# EAGLE design radical-pneu (EAGLE 7.2.0)
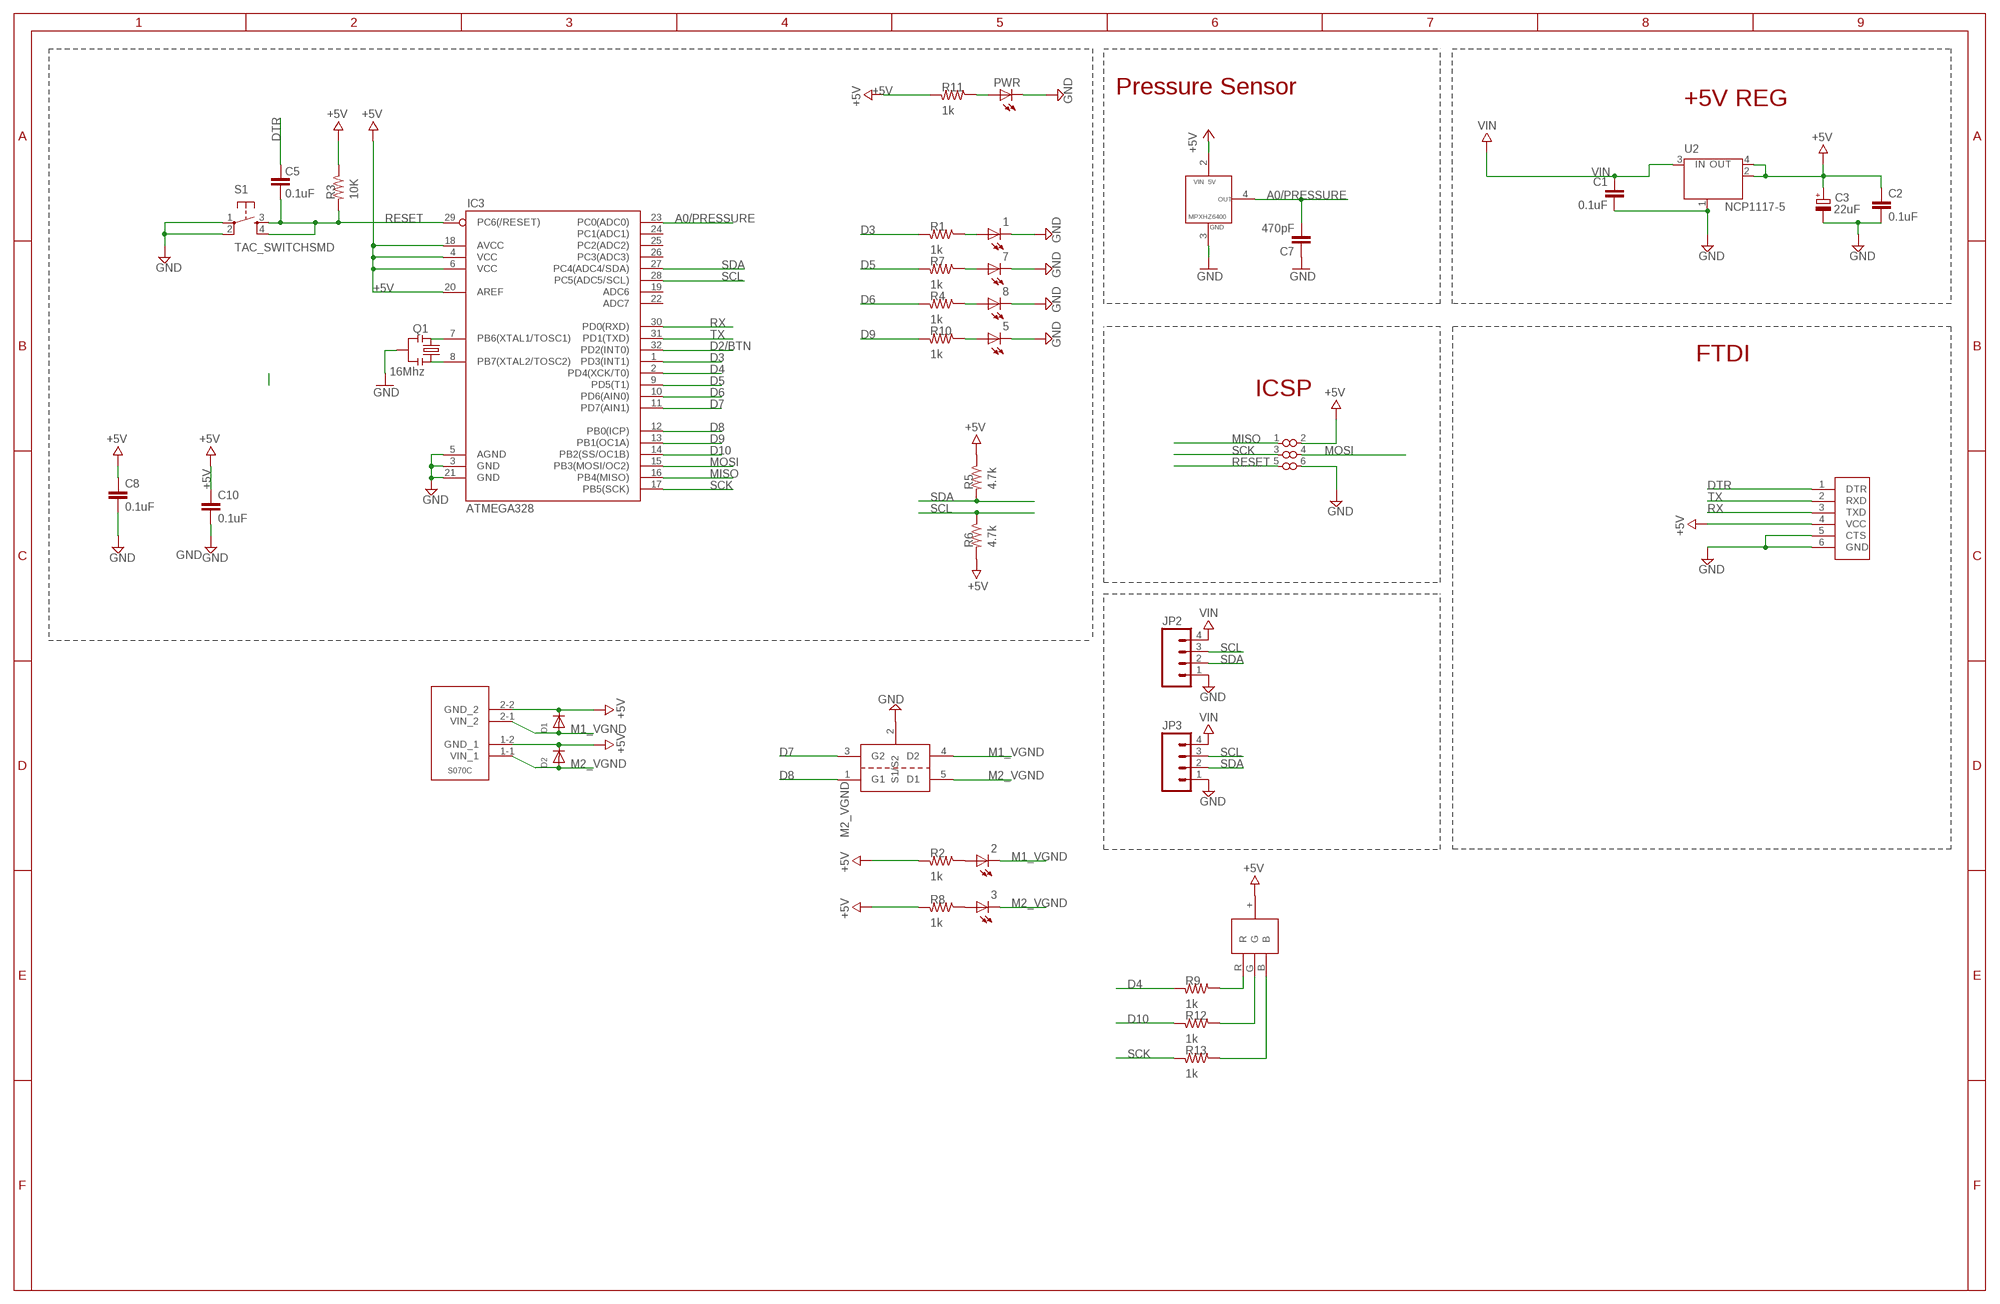
[diagram p0: schematic, sheet 1]

## Parts
1  LEDCHIPLED_0603  [CHIPLED_0603]
2  LEDCHIPLED_0603  [CHIPLED_0603]
3  LEDCHIPLED_0603  [CHIPLED_0603]
5  LEDCHIPLED_0603  [CHIPLED_0603]
7  LEDCHIPLED_0603  [CHIPLED_0603]
8  LEDCHIPLED_0603  [CHIPLED_0603]
C1  0.1uF  CAP0603-CAP  [0603-CAP]
C2  0.1uF  CAP0603-CAP  [0603-CAP]
C3  22uF  CPOL-EUSMCB  [SMC_B]
C5  0.1uF  CAP0805  [0805]
C7  470pF  CAP0805  [0805]
C8  0.1uF  CAP0603-CAP  [0603-CAP]
C10  0.1uF  CAP0603-CAP  [0603-CAP]
D1  DIODESOD-123  [SOD-123]
D2  DIODESOD-123  [SOD-123]
IC3  ATMEGA328  ATMEGA168  [TQFP32-08]
JP2  M04PTH  [1X04]
JP3  M04PTH  [1X04]
PWR  LEDCHIPLED_0603  [CHIPLED_0603]
Q1  16Mhz  RESONATORSMD  [RESONATOR-SMD]
R1  1k  RESISTOR0805-RES  [0805]
R2  1k  RESISTOR0805-RES  [0805]
R3  10K  RESISTOR0805-RES  [0805]
R4  1k  RESISTOR0805-RES  [0805]
R5  4.7k  RESISTOR0805-RES  [0805]
R6  4.7k  RESISTOR0805-RES  [0805]
R7  1k  RESISTOR0805-RES  [0805]
R8  1k  RESISTOR0805-RES  [0805]
R9  1k  RESISTOR0805-RES  [0805]
R10  1k  RESISTOR0805-RES  [0805]
R11  1k  RESISTOR0805-RES  [0805]
R12  1k  RESISTOR0805-RES  [0805]
R13  1k  RESISTOR0805-RES  [0805]
S1  TAC_SWITCHSMD  [TACTILE-SWITCH-SMD]
U2  NCP1117-5  LINEAR_MC33269ST  [LINEAR_SOT223]
U$1  MPXHZ6400  [MPXHZ6400]
U$3  QS5K2  [SOT23-5L]
U$10  ISP_POGO  [POGO_ISP]
U$11  S070V-2VALVE  [S070C-2]
U$12  FTDI_POGO  [FTDI_POGO]
U$21  LTST-C19FD1WT  [LTST]

## Nets
+5V: C2.1 C3.+ C8.1 C10.1 D1.C D2.C IC3.4(VCC) IC3.6(VCC) IC3.18(AVCC) IC3.20(AREF) R2.2 R3.1 R5.1 R6.2 R8.2 R11.2 U2.2(OUT) U2.4(OUT) U$1.2(VIN) U$10.2(VCC) U$11.1-2(GND_1) U$11.2-2(GND_2) U$12.4(VCC) U$21.+(VCC)
A0/PRESSURE: C7.2 IC3.23(PC0(ADC0)) U$1.4(P_OUT)
D2/BTN: IC3.32(PD2(INT0))
D3: IC3.1(PD3(INT1)) R1.2
D4: IC3.2(PD4(XCK/T0)) R9.2
D5: IC3.9(PD5(T1)) R7.2
D6: IC3.10(PD6(AIN0)) R4.2
D7: IC3.11(PD7(AIN1)) U$3.3(G2)
D8: IC3.12(PB0(ICP)) U$3.1(G1)
D9: IC3.13(PB1(OC1A)) R10.2
D10: IC3.14(PB2(SS/OC1B)) R12.2
DTR: C5.2 U$12.1(DTR)
GND: 1.C 5.C 7.C 8.C C1.2 C2.2 C3.- C7.1 C8.2 C10.2 IC3.3(GND) IC3.5(AGND) IC3.21(GND) JP2.1 JP3.1 PWR.C Q1.2 S1.1 S1.2 U2.1(GND/ADJ) U$1.3(GND) U$3.2(S1/S2) U$10.6(GND) U$12.5(CTS) U$12.6(GND)
M1_VGND: 2.C D1.A U$3.4(D2) U$11.2-1(VIN_2)
M2_VGND: 3.C D2.A U$3.5(D1) U$11.1-1(VIN_1)
MISO: IC3.16(PB4(MISO)) U$10.1(MISO)
MOSI: IC3.15(PB3(MOSI/OC2)) U$10.4(MOSI)
N$1: 8.A R4.1
N$3: 7.A R7.1
N$4: IC3.8(PB7(XTAL2/TOSC2)) Q1.1
N$5: 1.A R1.1
N$6: 2.A R2.1
N$7: 3.A R8.1
N$8: IC3.7(PB6(XTAL1/TOSC1)) Q1.3
N$9: 5.A R10.1
N$10: PWR.A R11.1
N$11: R9.1 U$21.R
N$12: R12.1 U$21.G
N$13: R13.1 U$21.B
RESET: C5.1 IC3.29(PC6(/RESET)) R3.2 S1.3 S1.4 U$10.5(RESET)
RX: IC3.30(PD0(RXD)) U$12.3(TXD)
SCK: IC3.17(PB5(SCK)) R13.2 U$10.3(SCK)
SCL: IC3.28(PC5(ADC5/SCL)) JP2.3 JP3.3 R6.1
SDA: IC3.27(PC4(ADC4/SDA)) JP2.2 JP3.2 R5.2
TX: IC3.31(PD1(TXD)) U$12.2(RXD)
VIN: C1.1 JP2.4 JP3.4 U2.3(IN)
Unconnected: IC3.19(ADC6) IC3.22(ADC7) IC3.24(PC1(ADC1)) IC3.25(PC2(ADC2)) IC3.26(PC3(ADC3))

## Notes on the sheet
- Pressure Sensor
- +5V REG
- FTDI
- ICSP

## Library data of the parts
1-3 5 7 8 PWR = adafruit:LED: LED OSRAM: - CHIPLED LG R971, LG N971, LY N971, LG Q971, LY Q971, LO R971, LY R971 LH N974, LH R974 LS Q976, LO Q976, LY Q976 LO Q996 - Hyper CHIPLED LW Q18S LB Q993, LB Q99A, LB R99A - SideLED LS A670, LO A670, LY A670, LG A670, LP A670 LB A673, LV A673, LT A673, LW A673 LH A674 LY A675 LS A676, LA A676, LO A676, LY A676, LW A676 LS A679, LY A679, LG A679 - Hyper Micro SIDELED® LS Y876, LA Y876, LO Y876, LY Y876 LT Y87S - SmartLED LW L88C, LW L88S LB L89C, LB L89S, LG L890 LS L89K, LO L89K, LY L89K LS L896, LA L896, LO L896, LY L896 - TOPLED LS T670, LO T670, LY T670, LG T670, LP T670 LSG T670, LSP T670, LSY T670, LOP T670, LYG T670 LG T671, LOG T671, LSG T671 LB T673, LV T673, LT T673, LW T673 LH T674 LS T676, LA T676, LO T676, LY T676, LB T676, LH T676, LSB T676, LW T676 LB T67C, LV T67C, LT T67C, LS T67K, LO T67K, LY T67K, LW E67C LS E67B, LA E67B, LO E67B, LY E67B, LB E67C, LV E67C, LT E67C LW T67C LS T679, LY T679, LG T679 LS T770, LO T770, LY T770, LG T770, LP T770 LB T773, LV T773, LT T773, LW T773 LH T774 LS E675, LA E675, LY E675, LS T675 LS T776, LA T776, LO T776, LY T776, LB T776 LHGB T686 LT T68C, LB T68C - Hyper Mini TOPLED® LB M676 - Mini TOPLED Santana® LG M470 LS M47K, LO M47K, LY M47K Source: http://www.osram.convergy.de/
C1 C2 C5 C8 C10 = SparkFun-Capacitors:CAP: Capacitor Standard 0603 ceramic capacitor, and 0.1" leaded capacitor.
C3 = rcl:CPOL-EU: POLARIZED CAPACITOR, European symbol
C7 = SparkFun-Passives:CAP: Capacitor Standard 0603 ceramic capacitor, and 0.1" leaded capacitor.
D1 D2 = adafruit:DIODE: Diode SMADIODE - SMA Surface Mount Package 20V 1A Schottky Diode Digikey: 641-1014-6-ND DO-1N4148 - Through Hole Small Current Diode SOD-123 20V 1 A (.5mV Vf) Schottky Diode - Digikey: MBRX120TPMSCT-ND SOD-323 10V 570mA (.38mV Vf, 3ns) Schottky Diode - Digikey: ZLLS410CT-ND SOD-523 30V 30mA Schottky Diode (RB751S-40TE61) - Digikey: RB751S-40TE61CT-ND SOT23-R/W - SOT23 Package (R = Solder Paste/Reflow Ovens, W = Hand-Soldering) BAT54Film 40V 300mA - Digikey: 497-7162-1-ND
IC3 = SparkFun:ATMEGA168
JP2 JP3 = SparkFun-Connectors:M04: Header 4 Standard 4-pin 0.1" header. Use with straight break away headers (SKU : PRT-00116), right angle break away headers (PRT-00553), swiss pins (PRT-00743), machine pins (PRT-00117), and female headers (PRT-00115). Molex polarized connector foot print use with SKU : PRT-08231 with associated crimp pins and housings. 1MM SMD Version SKU: PRT-10208
Q1 = SparkFun:RESONATOR: Resonator Small SMD resonator. This is the itty bitty 10/20MHz resonators with built in caps. CSTCE10M0G55 and CSTCE20M0V53. Footprint has been reviewed closely but hasn't been tested yet.
R1-R13 = SparkFun-Resistors:RESISTOR: Resistor Basic schematic elements and footprints for 0603, 1206, and PTH resistors.
S1 = SparkFun-Electromechanical:TAC_SWITCH: Momentary Switch Button commonly used for reset or general input. Spark Fun Electronics SKU : COM-00097 SMT- SWCH-08247; PROD_ID: SWCH-08247
U2 = SmartPrj:LINEAR_MC33269ST*: Adjustable Output Low Dropout Voltage Regulator 800 mA Source: http://www.onsemi.com/pub/Collateral/MC33269-D.PDF
U$1 = digikey:MPXHZ6400
U$3 = qs5k2:QS5K2
U$10 = digikey:ISP_POGO
U$11 = digikey:S070V-2VALVE
U$12 = digikey:FTDI_POGO
U$21 = digikey:LTST-C19FD1WT

## Net classes
1 vcc: width 0.254 mm

## Board
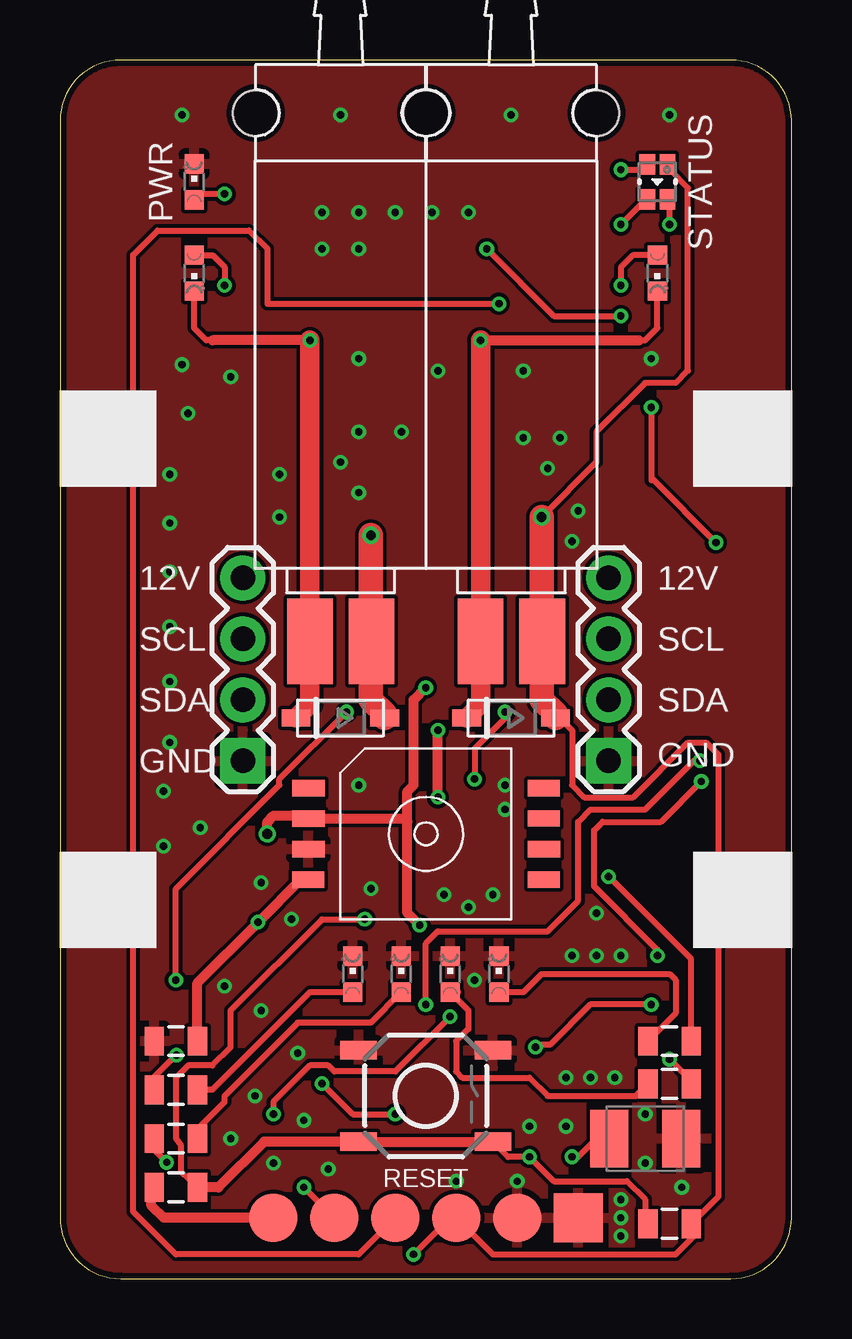
[diagram p1: board, top side]
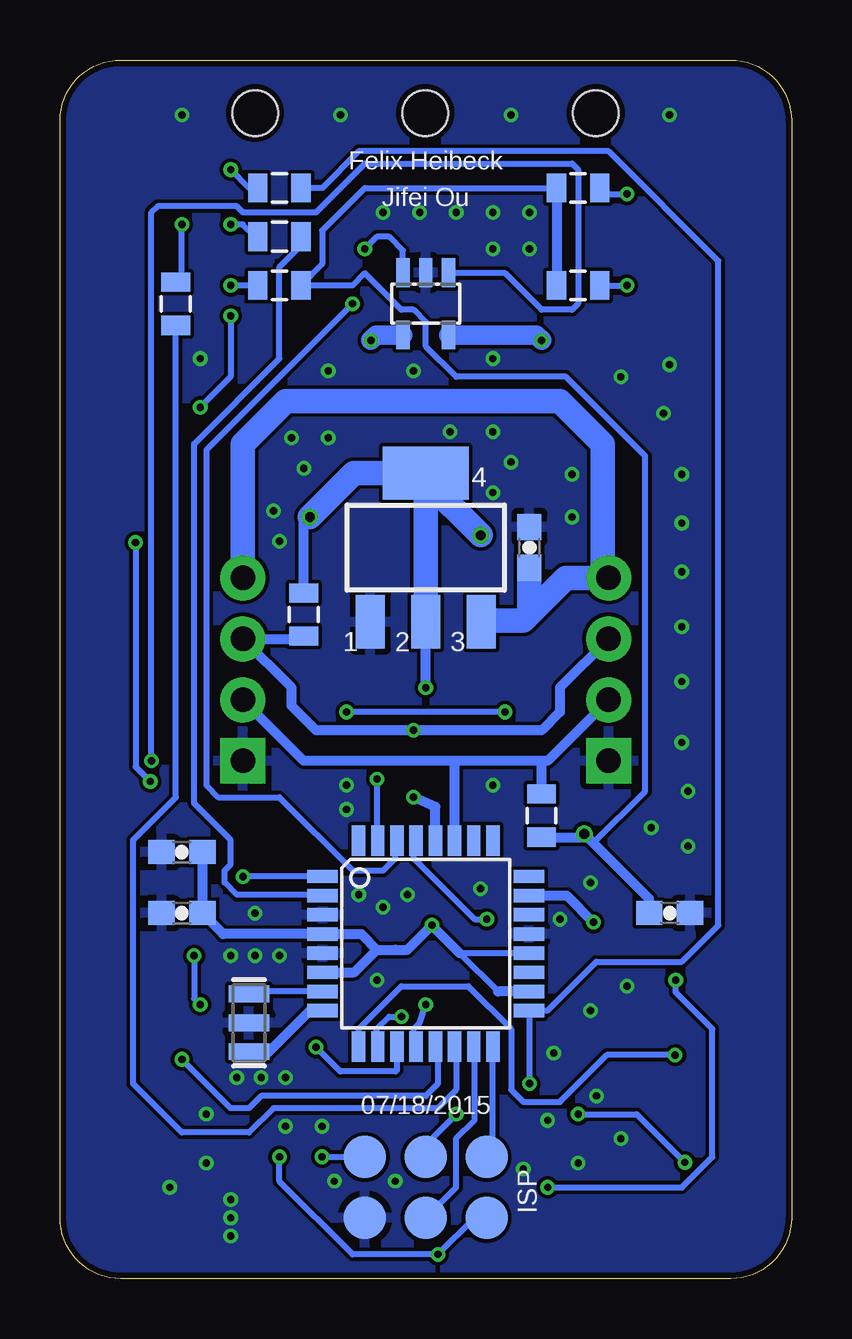
[diagram p2: board, bottom side, seen from below]

Size 30.48 x 50.8 mm. Coordinates in mm from the lower left corner, seen from the top.
Outline: 2.54,0 27.94,0 arc90 30.48,2.54 30.48,48.26 arc90 27.94,50.8 2.54,50.8 arc90 0,48.26 0,2.54 arc90 2.54,0
Copper layers (1*16): Top 0.035mm / dielectric 1.5mm / Bottom 0.035mm
Design rules "SeeedStudio_2layer_DRU_no_angle_20140221 *": minimum track width 6mil, minimum drill 12mil, track to track 6mil, track to pad 6mil, pad to pad 6mil, via to via 6mil, smd to smd 0mil, copper to edge 10mil, drill to drill 10mil, minimum pad ring 10mil, minimum via ring 6mil, stop-mask expansion 2mil, vias tented up to drill 100mil, thermal gap 10mil

### Footprints (pad centres in the part's own frame; a part is rotated, then mirrored left to right if it is on the bottom)
CHIPLED_0603 = smd 0.8 x 0.8: A 0,-0.75; C 0,0.75
0603-CAP = smd 1.1 x 1: 1 -0.85,0; 2 0.85,0
SMC_B = smd 1.6 x 2.4: + -1.5,0; - 1.5,0
0805 = smd 0.8 x 1.2: 1 -0.9,0; 2 0.9,0
SOD-123 = smd 1.2 x 0.7: A 1.85,0; C -1.85,0
TQFP32-08 = smd 1.27 x 0.559: 1 -4.293,2.8; 2 -4.293,2; 3 -4.293,1.2; 4 -4.293,0.4; 5 -4.293,-0.4; 6 -4.293,-1.2; 7 -4.293,-2; 8 -4.293,-2.8; 17 4.293,-2.8; 18 4.293,-2; 19 4.293,-1.2; 20 4.293,-0.4; 21 4.293,0.4; 22 4.293,1.2; 23 4.293,2; 24 4.293,2.8 | smd 0.559 x 1.27: 9 -2.8,-4.293; 10 -2,-4.293; 11 -1.2,-4.293; 12 -0.4,-4.293; 13 0.4,-4.293; 14 1.2,-4.293; 15 2,-4.293; 16 2.8,-4.293; 25 2.8,4.293; 26 2,4.293; 27 1.2,4.293; 28 0.4,4.293; 29 -0.4,4.293; 30 -1.2,4.293; 31 -2,4.293; 32 -2.8,4.293
1X04 = drill 1.016 pad 1.88 square: 1 0,0 | drill 1.016 pad 1.88: 2 2.54,0; 3 5.08,0; 4 7.62,0
RESONATOR-SMD = smd 0.7 x 1.7: 1 -1.2,0; 2 0,0; 3 1.2,0
TACTILE-SWITCH-SMD = smd 1.524 x 0.762: 1 -2.794,1.905; 2 2.794,1.905; 3 -2.794,-1.905; 4 2.794,-1.905
LINEAR_SOT223 = smd 1.219 x 2.235: 1 -2.311,-3.099; 2 0,-3.099; 3 2.311,-3.099 | smd 3.6 x 2.2: 4 0,3.099
MPXHZ6400 = smd 1.346 x 0.686: 1 -4.892,1.908; 2 -4.892,0.64; 3 -4.892,-0.632; 4 -4.897,-1.902; 5 4.915,-1.902; 6 4.923,-0.63; 7 4.92,0.643; 8 4.92,1.908
SOT23-5L = smd 0.55 x 1.2: 1 -0.95,-1.3; 2 0,-1.3; 3 0.95,-1.3; 4 0.95,1.3; 5 -0.95,1.3
POGO_ISP = smd 1.778 x 1.778: 1 -1.27,2.54; 2 1.27,2.54; 3 -1.27,0; 4 1.27,0; 5 -1.27,-2.54; 6 1.27,-2.54
S070C-2 = smd 1.905 x 3.556: 1-1 -4.826,-24.232; 1-2 -2.261,-24.232; 2-1 2.286,-24.232; 2-2 4.851,-24.232 | hole 1.9: -7.087,-2.21; 7.112,-2.21; 0.025,-2.21
FTDI_POGO = smd 2.032 x 2.032: 1 -6.35,0; 2 -3.81,0; 3 -1.27,0; 4 1.27,0; 5 3.81,0; 6 6.35,0
LTST = smd 0.65 x 0.85: + 0.425,0.725; B -0.425,0.725; G 0.425,-0.725; R -0.425,-0.725

### Placement (x,y rotation side)
1  18.29,12.7 0 top
2  24.89,41.91 180 top
3  5.59,41.91 180 top
5  16.26,12.7 0 top
7  12.19,12.7 0 top
8  14.22,12.7 0 top
C1  10.92,30.48 90 bottom
C2  5.08,15.24 0 bottom
C3  24.38,5.84 0 top
C5  4.83,3.81 180 top
C7  4.83,9.91 0 top
C8  25.4,15.24 180 bottom
C10  25.4,17.78 180 bottom
D1  18.8,23.37 180 top
D2  11.68,23.37 180 top
IC3  15.24,13.97 0 bottom
JP2  22.86,21.59 90 top
JP3  7.62,21.59 90 top
PWR  5.59,45.72 0 top
Q1  22.61,10.67 90 bottom
R1  25.4,9.91 0 top
R2  21.34,41.4 0 bottom
R3  25.4,2.29 180 top
R4  4.83,5.84 180 top
R5  10.41,19.3 90 bottom
R6  20.32,27.69 90 bottom
R7  4.83,7.87 180 top
R8  8.89,41.4 180 bottom
R9  21.34,43.43 0 bottom
R10  25.4,8.13 0 top
R11  8.89,45.47 180 bottom
R12  25.65,40.64 270 bottom
R13  21.34,45.47 0 bottom
S1  15.24,7.62 0 top
U2  15.24,30.48 0 bottom
U$1  15.24,18.54 0 top
U$3  15.24,40.64 180 bottom
U$10  15.24,3.81 270 bottom
U$11  15.24,50.8 0 top
U$12  15.24,2.54 0 top
U$21  24.89,45.72 0 top

### Tracks (layer width: path | path; a pad name or v marks a point on that pad's centre or on a via)
+5V  (via drill 0.3, 0.41)
  Top 0.254: v14.73,1.02 16.26,2.54 U$12.4 18.03,1.02 25.65,1.02 26.42,1.78 26.42,2.17 R3.1 27.43,3.42 27.43,21.84 26.92,22.35 26.16,22.35 23.88,20.07 21.84,20.07 21.34,20.57 21.34,22.86 21.08,23.11 D1.C | v21.34,5.08 21.59,5.08 22.86,6.35 C3.+ | U$21.+ 25.4,46.23 26.16,45.47 26.16,37.85 25.65,37.34 24.38,37.34 22.35,35.31 22.35,34.04 v20.07,31.75
  Top 0.406: v14.99,14.73 14.48,15.24 14.48,19.05 | 14.48,19.05 14.48,20.32 14.73,20.57 14.73,24.13 v15.24,24.64 | 14.48,19.05 14.35,19.18 U$1.2 10.23,19.3 8.89,19.3 8.64,19.05 v8.64,18.54
  Top 1.016: D2.C 13.53,23.55 12.95,24.13 12.95,26.54 U$11.1-2 12.95,26.59 v12.95,30.99 | D1.C 20.65,23.55 20.07,24.13 20.07,26.54 U$11.2-2 20.07,26.59 v20.07,31.75
  Bottom 0.254: IC3.20 13.82,13.57 12.22,11.97 | U$10.2 13.21,2.54 v14.73,1.02 18.29,1.02 21.34,4.06 v21.34,5.08 | 8.25,18.16 6.1,20.32 6.1,34.29 9.4,37.59 13.97,37.59 15.24,38.86 15.24,39.88 15.75,40.39 16.26,40.39 17.78,41.91 18.29,41.4 R2.2 19.56,42.28 19.56,43.69 17.78,45.47 R11.2
  Bottom 0.406: R6.2 20.32,31.5 v20.07,31.75 | C10.1 C8.1 23.68,14.37 IC3.4 17.93,14.37 17.27,13.72 | R11.2 R8.2 | IC3.6 18.22,12.77 17.27,13.72 | 13.82,13.57 v14.99,14.73 16,13.72 16.51,13.72 17.27,13.72 | IC3.18 12.22,11.97 | v15.24,24.64 U2.2 | R5.1 8.77,18.4 v8.64,18.54 8.25,18.16 5.93,15.84 C2.1
  Bottom 1.016: U2.2 U2.4 | U2.4 15.24,33.27 v12.95,30.99 | U2.4 18.24,33.58 v20.07,31.75
A0/PRESSURE  (via drill 0.3)
  Top 0.406: U$1.4 10.04,16.64 v8.25,14.86 5.73,12.33 C7.2
  Bottom 0.406: IC3.23 9.37,15.97 v8.25,14.86
D3  (via drill 0.3)
  Top 0.254: v22.86,16.76 26.3,13.32 R1.2
  Bottom 0.254: v22.86,16.76 19.56,16.76 IC3.1
D4
  Bottom 0.254: R9.2 20.57,43.43 20.57,42.93 21.34,42.16 21.34,38.35 24.89,34.8 24.89,19.81 23.37,18.29 23.37,17.27 23.62,17.02 23.62,16.51 23.11,16 19.56,16 IC3.2
D5  (via drill 0.3)
  Top 0.254: R7.2 3.81,7.99 3.81,8.28 v4.85,9.32
  Bottom 0.254: IC3.9 18.03,9.91 18.03,10.41 16.26,12.19 13.46,12.19 11.68,10.41 11.68,7.87 11.18,7.37 9.65,7.37 7.7,9.32 v4.85,9.32
D6  (via drill 0.3)
  Top 0.254: v16.26,10.92 13.97,8.64 11.43,8.64 11.18,8.89 10.41,8.89 8.89,7.37 v8.89,6.86 | R4.2 3.93,5.37 v4.45,4.85
  Bottom 0.254: v16.26,10.92 16.76,10.92 17.27,10.41 17.27,9.91 IC3.10 | v8.89,6.86 6.45,6.86 v4.45,4.85
D7  (via drill 0.3)
  Top 0.254: v17.78,42.93 20.57,40.13 v23.37,40.13 | v24.64,36.32 24.64,33.33 | 24.64,33.33 24.64,33.27 | v26.72,20.73 25.04,19.05 22.61,19.05 22.25,18.69 22.25,16.36 24.89,13.72 v24.89,13.46 | v27.33,30.68 24.69,33.33 24.64,33.33 | v19.81,9.65 19.81,9.75 20.42,9.75 22.1,11.43 v24.64,11.43
  Bottom 0.254: IC3.11 16.44,8.71 16.51,8.64 18.8,8.64 v19.81,9.65 | U$3.3 16.19,42.86 16.76,43.43 17.27,43.43 v17.78,42.93 | v23.37,40.13 23.37,37.59 v24.64,36.32 | v26.72,20.73 27.33,21.34 v27.33,30.68 | v24.89,13.46 24.89,11.68 v24.64,11.43
D8  (via drill 0.3)
  Top 0.254: v15.24,11.43 15.24,13.97 15.75,14.48 20.32,14.48 21.59,15.75 21.59,19.05 22.1,19.56 24.38,19.56 26.42,21.59 v26.67,21.59
  Bottom 0.254: v26.67,21.59 26.67,44.45 26.42,44.7 23.11,44.7 22.86,44.45 19.81,44.45 17.78,46.48 9.14,46.48 8.89,46.23 8.89,40.64 9.14,40.39 10.41,40.39 11.94,41.91 14.22,41.91 U$3.1 | v15.24,11.43 15.49,10.67 15.75,10.41 15.75,9.91 IC3.12
D9  (via drill 0.3)
  Top 0.254: R10.2 26.3,8.5 26.05,8.5 v25.4,9.14
  Bottom 0.254: IC3.13 14.73,9.65 14.73,8.13 15.24,7.62 22.1,7.62 22.61,7.11 23.37,7.11 v25.4,9.14
D10
  Bottom 0.254: R12.2 25.65,20.07 27.43,18.29 27.43,8.13 25.4,6.1 22.61,6.1 21.59,7.11 14.73,7.11 13.97,7.87 13.97,9.65 IC3.14
DTR
  Top 0.406: U$12.1 4.32,2.54 3.81,3.05 3.81,3.69 C5.2
GND  (via drill 0.3)
  Bottom 0.254: U$10.6 18.54,2.54
  other vias: 17.02,44.45 15.49,44.45 13.97,44.45 12.45,44.45 10.92,44.45 10.92,42.93 12.45,42.93 5.08,48.51 11.68,48.51 18.8,48.51 5.84,18.8 8.38,16.51 19.56,6.35 21.08,6.35 25.91,3.81 21.34,13.46 22.35,13.46 18.03,16 12.95,16.26 18.54,19.56 8.38,11.18 9.65,14.99 22.35,15.24 16,16 20.32,33.78 24.64,38.35 11.68,34.04 4.57,31.5 25.4,48.51 19.3,37.85 6.86,12.19 9.91,9.4 10.16,6.6 7.11,5.84 23.11,8.38 19.05,4.06 8.89,4.83 17.27,12.45 17.02,15.49 20.83,35.05 12.45,32.77 5.08,38.1 23.37,1.78 24.38,6.86 16.51,4.06 22.1,8.38 21.08,8.38 9.14,33.53 9.14,31.75 5.33,36.07 7.11,37.59 15.75,37.85 12.45,38.35 4.57,33.53 4.57,29.46 18.54,20.57 12.45,20.57 24.38,4.83 21.59,32 21.34,30.73 11.18,4.57 19.3,35.05 12.45,35.31 4.32,18.03 4.32,20.32 14.22,35.31 4.57,27.18 4.57,24.89 4.57,22.35 23.37,2.54 23.37,3.3 8.13,7.62 23.37,13.46
  pour Bottom: 0.25,55.12 30.73,55.37 30.73,-2.79 0.25,-3.05
  pour Top: -1.02,54.36 30.73,54.36 30.73,-2.29 -1.02,-2.29
M1_VGND  (via drill 0.3)
  Top 0.254: 24.12,39.12 24.38,39.12 24.89,39.62 2.C
  Top 0.406: v17.53,39.12 24.12,39.12
  Top 0.813: v17.53,39.12 U$11.2-1 17.53,23.95 D1.A
  Bottom 0.813: U$3.4 17.3,39.34 v17.53,39.12
M2_VGND  (via drill 0.3)
  Top 0.254: 6.36,39.12 6.1,39.12 5.59,39.62 3.C
  Top 0.406: v10.41,39.12 6.36,39.12
  Top 0.813: v10.41,39.12 U$11.1-1 10.41,23.95 D2.A
  Bottom 0.813: U$3.5 10.64,39.34 v10.41,39.12
MISO
  Bottom 0.254: U$10.1 12.45,5.33 12.45,9.65 IC3.16
MOSI
  Bottom 0.254: U$10.4 13.97,3.81 13.97,5.84 13.21,6.6 13.21,9.65 IC3.15
N$1
  Top 0.254: R4.1 5.84,5.96 5.84,6.35 6.86,7.37 6.86,7.62 9.91,10.67 12.94,10.67 8.A
N$3
  Top 0.254: R7.1 6.35,7.87 10.41,11.94 12.18,11.94 7.A
N$4
  Bottom 0.254: 21.84,9.4 22.54,9.4 Q1.1
  Bottom 0.406: IC3.8 20.07,11.17 21.84,9.4
N$5
  Top 0.254: 1.A 19.32,11.95 20.07,12.7 25.4,12.7 25.65,12.45 25.65,11.06 R1.1 24.64,10.04
N$6  (via drill 0.3)
  Top 0.254: 2.A 23.86,42.66 23.37,42.16 v23.37,41.4
  Bottom 0.254: R2.1 v23.37,41.4
N$7  (via drill 0.3)
  Top 0.254: 3.A 6.36,42.66 6.86,42.16 v6.86,41.4
  Bottom 0.254: R8.1 v6.86,41.4
N$8
  Bottom 0.254: IC3.7 22.5,11.97 Q1.3
N$9
  Top 0.254: 16.51,11.94 16.51,11.68 17.02,11.18 17.02,10.41 16.51,9.91 16.51,8.64 16.76,8.38 19.56,8.38 20.32,7.62 23.99,7.62 R10.1
  Top 0.406: 5.A 16.51,11.94
N$10  (via drill 0.3)
  Top 0.254: v6.86,45.21 5.59,45.21 PWR.A
  Bottom 0.254: v6.86,45.21 7.62,45.21 7.87,45.47 R11.1
N$11  (via drill 0.3)
  Top 0.254: v23.37,43.94 24.38,44.96 U$21.R
  Bottom 0.254: v23.37,43.94 22.86,43.94 22.35,43.43 R9.1
N$12  (via drill 0.3)
  Top 0.254: v25.4,43.94 25.4,44.96 U$21.G
  Bottom 0.254: v25.4,43.94 25.4,41.91 25.65,41.66 R12.1
N$13  (via drill 0.3)
  Top 0.254: v23.37,46.23 24.38,46.23 U$21.B
  Bottom 0.254: v23.37,46.23 22.61,45.47 R13.1
RESET  (via drill 0.3)
  Top 0.254: v12.7,14.99 10.92,14.99 7.11,11.18 7.11,9.65 6.35,8.89 5.33,8.89 4.83,8.38 4.83,5.84 5.03,5.59 5.03,4.46 C5.1 5.59,3.81 | S1.4 18.67,5.08 v19.56,5.08 20.57,4.06 23.62,4.06 24.38,3.3 24.38,2.4 R3.2
  Top 0.406: S1.4 S1.3 8.51,5.71 6.6,3.81 C5.1
  Bottom 0.254: IC3.29 15.75,18.03 15.75,17.53 13.21,14.99 v12.7,14.99 | v19.56,5.08 U$10.5
RX  (via drill 0.3)
  Top 0.254: v18.29,40.64 8.64,40.64 8.64,42.93 7.87,43.69 4.06,43.69 3.05,42.67 3.05,2.79 4.83,1.02 12.45,1.02 U$12.3
  Bottom 0.254: v18.29,40.64 24.38,34.54 24.38,20.57 23.88,20.07 21.34,20.07 18.29,17.02 17.02,17.02 16.51,17.53 16.51,18.03 IC3.30
SCK  (via drill 0.3)
  Top 0.254: v13.97,6.86 12.19,6.86 v10.92,8.13
  Bottom 0.254: R13.2 19.56,45.47 18.03,46.99 7.62,46.99 3.05,42.42 3.05,14.73 4.57,13.21 8.13,13.21 10.16,11.18 10.92,11.18 IC3.17 10.92,10.92 v10.92,8.13 | U$10.3 15.24,5.59 v13.97,6.86
SCL  (via drill 0.3)
  Top 0.406: v15.75,20.07 v15.75,22.86
  Bottom 0.406: JP3.3 9.65,24.64 9.65,23.62 10.41,22.86 v15.75,22.86 19.81,22.86 20.83,23.88 20.83,24.64 JP2.3 20.44,26.67 R6.1 | IC3.28 14.84,19.67 v15.75,20.07
SDA
  Bottom 0.406: JP3.2 10.16,21.59 10.41,21.59 | 10.41,21.59 13.97,21.59 | 13.97,21.59 20.32,21.59 JP2.2 | IC3.27 14.04,21.52 13.97,21.59 | R5.2 10.41,21.59
TX  (via drill 0.3)
  Top 0.254: v17.27,20.83 17.27,22.1 18.54,23.37 v18.54,23.62 | v11.94,23.62 9.14,20.83 9.14,20.57 4.83,16.26 v4.83,12.45 | U$12.2 v10.16,3.81
  Bottom 0.254: v17.27,20.83 17.27,18.29 IC3.31 | v11.94,23.62 v18.54,23.62 | v4.83,12.45 4.83,11.94 3.3,10.41 3.3,5.08 4.57,3.81 v10.16,3.81
VIN
  Bottom 0.406: U2.3 12.95,27.38 12.95,27.18
  Bottom 1.016: JP3.4 7.87,29.21 | 7.87,29.21 9.4,29.21 10.8,27.81 | 10.8,27.81 11.18,27.43 12.88,27.43 U2.3 | C1.1 10.92,27.94 10.8,27.81 | 7.87,29.21 7.87,34.8 9.65,36.58 21.08,36.58 22.86,34.8 JP2.4

### Text on the board
tPlace: STATUS
tNames: 12V | 12V | SCL | SCL | SDA | SDA | GND | GND | RESET
bNames: Felix Heibeck | Jifei Ou | 07/18/2015